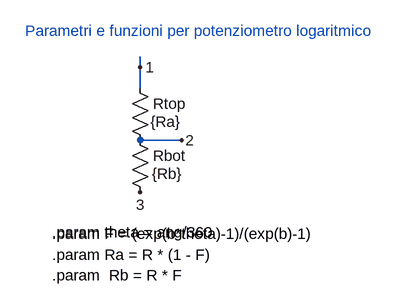
[diagram p0: schematic pot_log.asc]
pot_log.asc, the LTspice schematic file:
Version 4
SHEET 1 880 680
WIRE 208 -64 208 -80
WIRE 208 -32 208 -64
WIRE 272 48 208 48
FLAG 208 -64 1
FLAG 272 48 2
FLAG 208 128 3
SYMBOL res 192 -48 R0
WINDOW 3 32 68 Left 2
SYMATTR Value {Ra}
SYMATTR InstName Rtop
SYMBOL res 192 32 R0
WINDOW 3 34 68 Left 2
SYMATTR Value {Rb}
SYMATTR InstName Rbot
TEXT 24 -120 Left 2 ; Parametri e funzioni per potenziometro logaritmico
TEXT 72 190 Left 2 !.param theta = ang/360
TEXT 72 192 Left 2 !.param F = (exp(b*theta)-1)/(exp(b)-1)
TEXT 72 224 Left 2 !.param Ra = R * (1 - F)
TEXT 72 256 Left 2 !.param  Rb = R * F

The netlist it stands for:
* pot_log.asc
Rtop 1 2 {Ra}
Rbot 2 3 {Rb}
*  Parametri e funzioni per potenziometro logaritmico
.param theta = ang/360
.param F = (exp(b*theta)-1)/(exp(b)-1)
.param Ra = R * (1 - F)
.param  Rb = R * F
.backanno
.end